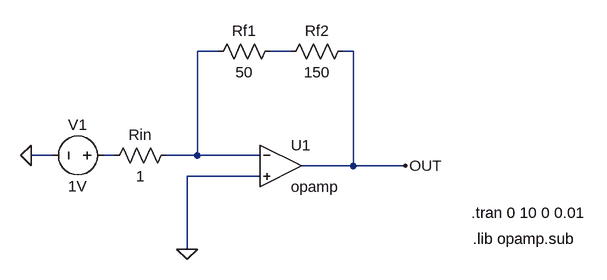
[diagram p0: schematic inverting_opamp.asc]
inverting_opamp.asc, the LTspice schematic file:
Version 4
SHEET 1 880 680
WIRE 112 -48 80 -48
WIRE 224 -48 192 -48
WIRE 320 -48 304 -48
WIRE -144 112 -176 112
WIRE -48 112 -64 112
WIRE 80 112 80 -48
WIRE 80 112 32 112
WIRE 176 112 80 112
WIRE 320 128 320 -48
WIRE 320 128 240 128
WIRE 400 128 320 128
WIRE 176 144 64 144
WIRE 64 256 64 144
FLAG 64 256 0
FLAG 400 128 OUT
FLAG -176 112 0
SYMBOL res 48 96 R90
WINDOW 0 0 56 VBottom 2
WINDOW 3 32 56 VTop 2
SYMATTR InstName Rin
SYMATTR Value 1
SYMBOL res 208 -64 R90
WINDOW 0 0 56 VBottom 2
WINDOW 3 32 56 VTop 2
SYMATTR InstName Rf1
SYMATTR Value 50
SYMBOL voltage -48 112 R90
WINDOW 0 -32 56 VBottom 2
WINDOW 3 32 56 VTop 2
SYMATTR InstName V1
SYMATTR Value 1V
SYMBOL Opamps\\opamp 208 64 R0
SYMATTR InstName U1
SYMBOL res 320 -64 R90
WINDOW 0 0 56 VBottom 2
WINDOW 3 32 56 VTop 2
SYMATTR InstName Rf2
SYMATTR Value 150
TEXT 502 200 Left 2 !.tran 0 10 0 0.01
TEXT 504 240 Left 2 !.lib opamp.sub

The netlist it stands for:
* inverting_opamp.asc
Rin N001 N003 1
Rf1 N002 N001 50
V1 N003 0 1V
XU1 N001 0 OUT opamp Aol=100K GBW=10Meg  ; pins invin noninvin out
Rf2 OUT N002 150
.tran 0 10 0 0.01
.lib opamp.sub
.backanno
.end